# Altium schematic sheet Digital.SchDoc
size 355 x 266 mm; SheetNumber: 3; SheetTotal: 3
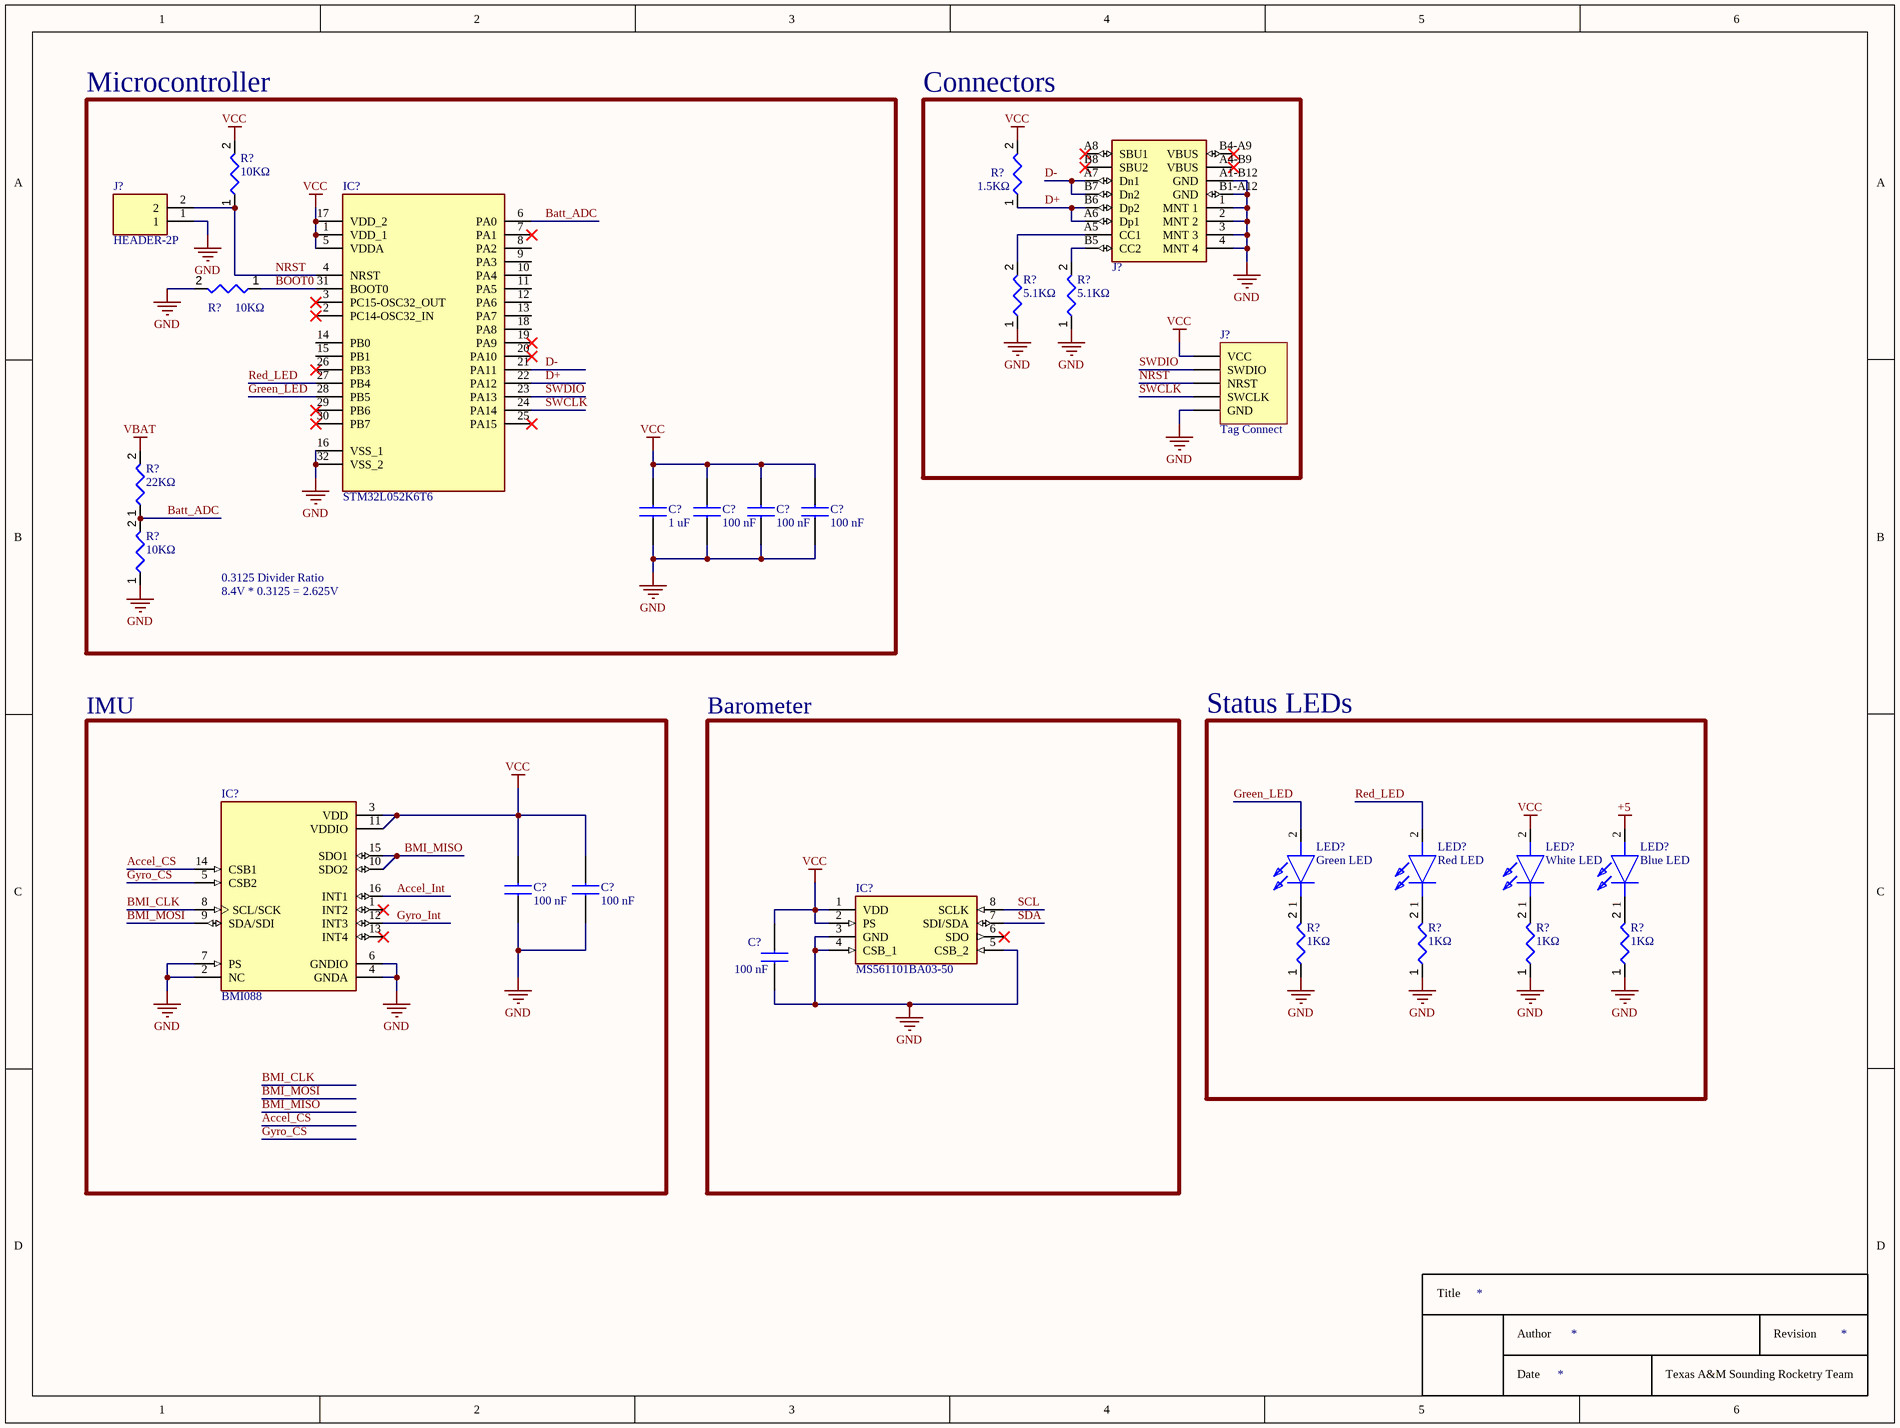
[diagram p0: Digital.SchDoc]

## Parts
(Parts that share a designator on the sheet are numbered #1, #2 ... from top to bottom, then left to right.)
C?#1  1 uF  [CAP_0603]
C?#2  100 nF  [CAP_0603]
C?#3  100 nF  [CAP_0603]
C?#4  100 nF  [CAP_0603]
C?#5  100 nF  [CAP_0603]
C?#6  100 nF  [CAP_0603]
C?#7  100 nF  [CAP_0603]
IC?#1  STM32L052K6T6  [QFP80P900X900X160-32N]
IC?#2  BMI088  [PQFN50P450X300X100-16N]
IC?#3  MS561101BA03-50  [MS561101BA03-50]
J?#1  USB-C  [FP-USB4105-GF-A-MFG]  (value not drawn)
J?#2  HEADER-2P  [HDRV2W110P0X254_1X2_508X254X854P]
J?#3  Tag Connect  [TC2030-MCP]
LED?#1  Green LED  [LEDC2012X90N]
LED?#2  Red LED  [LEDC2012X90N]
LED?#3  White LED  [LEDC2012X90N]
LED?#4  Blue LED  [LEDC2012X90N]
R?#1  10KΩ  [RES_0603]
R?#2  1.5KΩ  [RES_0603]
R?#3  10KΩ  [RES_0603]
R?#4  5.1KΩ  [RES_0603]
R?#5  5.1KΩ  [RES_0603]
R?#6  22KΩ  [RES_0603]
R?#7  10KΩ  [RES_0603]
R?#8  1KΩ  [RES_0603]
R?#9  1KΩ  [RES_0603]
R?#10  1KΩ  [RES_0603]
R?#11  1KΩ  [RES_0603]

## Blocks framed on the sheet
Microcontroller: C?#1-C?#4 IC?#1 J?#2 R?#1 R?#3 R?#6 R?#7
Connectors: J?#1 J?#3 R?#2 R?#4 R?#5
IMU: C?#5 C?#6 IC?#2
Barometer: C?#7 IC?#3
Status LEDs: LED?#1-LED?#4 R?#8-R?#11

## Nets
+5: LED?#4.2(A)
GND: C?#1.1 C?#2.1 C?#3.1 C?#4.1 C?#5.2 C?#6.2 C?#7.1 IC?#1.16(VSS_1) IC?#1.32(VSS_2) IC?#2.2(NC) IC?#2.4(GNDA) IC?#2.6(GNDIO) IC?#2.7(PS) IC?#3.3(GND) IC?#3.4(CSB_1) IC?#3.5(CSB_2) J?#1.1(MNT_1) J?#1.2(MNT_2) J?#1.3(MNT_3) J?#1.4(MNT_4) J?#1.A1-B12(GND) J?#1.B1-A12(GND) J?#2.1 J?#3.5(GND) R?#3.2 R?#4.1 R?#5.1 R?#7.1 R?#8.1 R?#9.1 R?#10.1 R?#11.1
VBAT: R?#6.2
VCC: C?#1.2 C?#2.2 C?#3.2 C?#4.2 C?#5.1 C?#6.1 C?#7.2 IC?#1.1(VDD_1) IC?#1.5(VDDA) IC?#1.17(VDD_2) IC?#2.3(VDD) IC?#2.11(VDDIO) IC?#3.1(VDD) IC?#3.2(PS) J?#3.1(VCC) LED?#3.2(A) R?#1.2 R?#2.2
Accel_CS: IC?#2.14(CSB1)
Accel_Int: IC?#2.16(INT1)
Batt_ADC: IC?#1.6(PA0) R?#6.1 R?#7.2
BMI_CLK: IC?#2.8(SCL/SCK)
BMI_MISO: IC?#2.10(SDO2) IC?#2.15(SDO1)
BMI_MOSI: IC?#2.9(SDA/SDI)
BOOT0: IC?#1.31(BOOT0) R?#3.1
D+: IC?#1.22(PA12) J?#1.A6(Dp1) J?#1.B6(Dp2) R?#2.1
D-: IC?#1.21(PA11) J?#1.A7(Dn1) J?#1.B7(Dn2)
Green_LED: IC?#1.28(PB5) LED?#1.2(A)
Gyro_CS: IC?#2.5(CSB2)
Gyro_Int: IC?#2.12(INT3)
NRST: IC?#1.4(NRST) J?#2.2 J?#3.3(NRST) R?#1.1
Red_LED: IC?#1.27(PB4) LED?#2.2(A)
SCL: IC?#3.8(SCLK)
SDA: IC?#3.7(SDI/SDA)
SWCLK: IC?#1.24(PA14) J?#3.4(SWCLK)
SWDIO: IC?#1.23(PA13) J?#3.2(SWDIO)
NetJ?#1_A5: J?#1.A5(CC1) R?#4.2
NetJ?#1_B5: J?#1.B5(CC2) R?#5.2
NetLED?#1_1: LED?#1.1(K) R?#8.2
NetLED?#2_1: LED?#2.1(K) R?#9.2
NetLED?#3_1: LED?#3.1(K) R?#10.2
NetLED?#4_1: LED?#4.1(K) R?#11.2

Not connected (* = marked no-connect by the designer): IC?#1 2(PC14-OSC32_IN)* 3(PC15-OSC32_OUT)* 7(PA1)* 8(PA2) 9(PA3) 10(PA4) 11(PA5) 12(PA6) 13(PA7) 14(PB0) 15(PB1) 18(PA8) 19(PA9)* 20(PA10)* 25(PA15)* 26(PB3)* 29(PB6)* 30(PB7)*; IC?#2 1(INT2)* 13(INT4)*; IC?#3 6(SDO)*; J?#1 A4-B9(VBUS)* A8(SBU1)* B4-A9(VBUS)* B8(SBU2)*

## Notes on the sheet
- 0.3125 Divider Ratio
- 8.4V * 0.3125 = 2.625V
- Title
- Author
- Date
- Texas A&M Sounding Rocketry Team
- Revision

## Library data of the parts
C?#1 = 1 uF Capacitor, 0603: Multilayer Ceramic Capacitors MLCC - SMD/SMT KGM15BR71H224JT NEW GLOBAL PN 50V 0.22uF A 581-KGM15BR71H224JT; Manufacturer 1: KYOCERA AVX; Manufacturer Part Number 1: 06033C105KAT2A; Tolerance: 10%; Voltage: 25 V; Value: 1 uF; Package: 0603; Library Ref: Capacitor_BASE; Design Item ID: 1 uF Capacitor, 0603; Supplier 1: Mouser; Supplier Part Number 1: 581-06033C105KAT2A
C?#2-C?#7 = 100 nF Capacitor, 0603: Multilayer Ceramic Capacitors MLCC - SMD/SMT KGM15BR71H104JT NEW GLOBAL PN 50V 0.1uF A 581-KGM15BR71H104JT; Manufacturer 1: KYOCERA AVX; Manufacturer Part Number 1: 06035C104JAT2A; Tolerance: 5%; Value: 100 nF; Voltage: 50 V; Package: 0603; Library Ref: Capacitor_BASE; Design Item ID: 100 nF Capacitor, 0603; Supplier 1: Mouser; Supplier Part Number 1: 581-06035C104JAT2A
IC?#1 = STM32L052K6T6: Integrated Circuit; Manufacturer_Name: STMicroelectronics; Datasheet Link: https://www.st.com/resource/en/datasheet/stm32l052c6.pdf; Height: 1.6mm; Manufacturer_Part_Number: STM32L052K6T6; Mouser Part Number: 511-STM32L052K6T6; Mouser Price/Stock: https://www.mouser.co.uk/ProductDetail/STMicroelectronics/STM32L052K6T6?qs=s5SkPsIz108xCpQ1lakLfA%3D%3D; Arrow Part Number: STM32L052K6T6; Arrow Price/Stock: https://www.arrow.com/en/products/stm32l052k6t6/stmicroelectronics?region=nac
IC?#2 = BMI088: High-performance 6-axis inertial sensor (accelerometer + gyroscope); Price: None; Value: *; Pin Count: 16; Package: None; Availability: Unavailable; Source: BMI088.SchLib; Component Type: Standard; Design Item ID: BMI088; MP: BMI088; Supplier 1: Mouser; Supplier Part Number 1: 262-BMI088
IC?#3 = MS561101BA03-50: Integrated Circuit; Manufacturer_Name: TE Connectivity; Datasheet Link: https://www.te.com/commerce/DocumentDelivery/DDEController?Action=srchrtrv&DocNm=MS5611-01BA03&DocType=Data%20Sheet&DocLang=English&PartCntxt=MS561101BA03-50&DocFormat=pdf; Manufacturer_Part_Number: MS561101BA03-50; Mouser Part Number: 824-MS561101BA03-50; Mouser Price/Stock: https://www.mouser.co.uk/ProductDetail/Measurement-Specialties/MS561101BA03-50?qs=%252BgKeJhng5iV%252BnCz6Qd5iDw%3D%3D; Arrow Part Number: MS561101BA03-50; Arrow Price/Stock: https://www.arrow.com/en/products/ms561101ba03-50/te-connectivity?utm_currency=USD&region=nac; Supplier 1: Mouser; Supplier Part Number 1: 824-MS561101BA03-50
J?#1 = USB-C: USB4105-GF-A; MPN: USB4105-GF-A; Supplier 1: Mouser; Supplier Part Number 1: 640-USB4105-GF-A
J?#2 = HEADER-2P: Connector / 61300211121; Manufacturer_Name: Wurth Elektronik; Datasheet Link: https://componentsearchengine.com/Datasheets/2/61300211121.pdf; Height: 8.54mm; Manufacturer_Part_Number: 61300211121; Mouser Part Number: 710-61300211121; Mouser Price/Stock: https://www.mouser.co.uk/ProductDetail/Wurth-Elektronik/61300211121?qs=t4813l51qx%252B1A5GYDQxPlw%3D%3D; Supplier 1: Mouser; Supplier Part Number 1: 710-61300211121
LED?#1 = Green LED: LED; Manufacturer_Name: Avago Technologies; Manufacturer_Part_Number: HSMW-C170-U0000; Datasheet Link: https://componentsearchengine.com/Datasheets/2/HSMW-C170-U0000.pdf; Height: 0.9mm; Mouser Part Number: 630-HSMW-C170-U0000; Mouser Price/Stock: https://www.mouser.co.uk/ProductDetail/Broadcom-Avago/HSMW-C170-U0000?qs=tMOYG%252Bw4%252BLwGyeHODzQdug%3D%3D; Supplier 1: Mouser; Supplier Part Number 1: 630-HSMQ-C170-T0000
LED?#2 = Red LED: LED; Manufacturer_Name: Avago Technologies; Manufacturer_Part_Number: HSMW-C170-U0000; Datasheet Link: https://componentsearchengine.com/Datasheets/2/HSMW-C170-U0000.pdf; Height: 0.9mm; Mouser Part Number: 630-HSMW-C170-U0000; Mouser Price/Stock: https://www.mouser.co.uk/ProductDetail/Broadcom-Avago/HSMW-C170-U0000?qs=tMOYG%252Bw4%252BLwGyeHODzQdug%3D%3D; Supplier 1: Mouser; Supplier Part Number 1: 630-HSMC-C170-T0000
LED?#3 = White LED: LED; Manufacturer_Name: Avago Technologies; Manufacturer_Part_Number: HSMW-C170-U0000; Datasheet Link: https://componentsearchengine.com/Datasheets/2/HSMW-C170-U0000.pdf; Height: 0.9mm; Mouser Part Number: 630-HSMW-C170-U0000; Mouser Price/Stock: https://www.mouser.co.uk/ProductDetail/Broadcom-Avago/HSMW-C170-U0000?qs=tMOYG%252Bw4%252BLwGyeHODzQdug%3D%3D; Supplier 1: Mouser; Supplier Part Number 1: 630-HSMW-C170-U0000
LED?#4 = Blue LED: LED; Manufacturer_Name: Avago Technologies; Manufacturer_Part_Number: HSMW-C170-U0000; Datasheet Link: https://componentsearchengine.com/Datasheets/2/HSMW-C170-U0000.pdf; Height: 0.9mm; Mouser Part Number: 630-HSMW-C170-U0000; Mouser Price/Stock: https://www.mouser.co.uk/ProductDetail/Broadcom-Avago/HSMW-C170-U0000?qs=tMOYG%252Bw4%252BLwGyeHODzQdug%3D%3D; Supplier 1: Mouser; Supplier Part Number 1: 630-HSMR-C170-R0000
R?#1 R?#3 R?#7 = 10 KOhm Resistor: Thick Film Resistors - SMD General Purpose Chip Resistor 0603, 10kOhms, 1%, 1/10W; Manufacturer 1: YAGEO; Manufacturer Part Number 1: RC0603FR-0710KL; Tolerance: 0.01; Power: 0.1W; Value: 10KΩ; Package: 0603; Library Ref: Resistor_BASE; Design Item ID: 10 KOhm Resistor; Supplier 1: Mouser; Supplier Part Number 1: 603-RC0603FR-0710KL
R?#2 = 1.5 KOhm Resistor: Thick Film Resistors - SMD General Purpose Chip Resistor 0603, 1.5kOhms, 1%, 1/10W; Manufacturer 1: YAGEO; Manufacturer Part Number 1: RC0603FR-071K5L; Tolerance: 0.01; Power: 0.1W; Value: 1.5KΩ; Package: 0603; Library Ref: Resistor_BASE; Design Item ID: 1.5 KOhm Resistor; Supplier 1: Mouser; Supplier Part Number 1: 603-RC0603FR-071K5L
R?#4 R?#5 = 5.1 KOhm Resistor: Thick Film Resistors - SMD General Purpose Chip Resistor 0603, 5.1kOhms, 1%, 1/10W; Manufacturer 1: YAGEO; Manufacturer Part Number 1: RC0603FR-075K1L; Tolerance: 0.01; Power: 0.1W; Value: 5.1KΩ; Package: 0603; Library Ref: Resistor_BASE; Design Item ID: 5.1 KOhm Resistor; Supplier 1: Mouser; Supplier Part Number 1: 603-RC0603FR-075K1L
R?#6 = 22 KOhm Resistor: Thick Film Resistors - SMD General Purpose Chip Resistor 0603, 22kOhms, 1%, 1/10W; Manufacturer 1: YAGEO; Manufacturer Part Number 1: RC0603FR-0722KL; Tolerance: 0.01; Power: 0.1W; Value: 22KΩ; Package: 0603; Library Ref: Resistor_BASE; Design Item ID: 22 KOhm Resistor; Supplier 1: Mouser; Supplier Part Number 1: 603-RC0603FR-0722KL
R?#8-R?#11 = 1 KOhm Resistor: Thick Film Resistors - SMD General Purpose Chip Resistor 0603, 1kOhms, 1%, 1/10W; Manufacturer 1: YAGEO; Manufacturer Part Number 1: RC0603FR-071KL; Tolerance: 0.01; Power: 0.1W; Value: 1KΩ; Package: 0603; Library Ref: Resistor_BASE; Design Item ID: 1 KOhm Resistor; Supplier 1: Mouser; Supplier Part Number 1: 603-RC0603FR-071KL